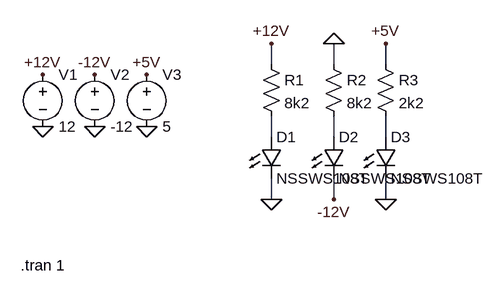
[diagram p0: schematic Draft3.asc]
Draft3.asc, the LTspice schematic file:
Version 4
SHEET 1 880 680
WIRE 336 96 336 64
WIRE 432 96 432 64
WIRE 512 96 512 64
WIRE 336 208 336 176
WIRE 432 208 432 176
WIRE 512 208 512 176
WIRE 336 304 336 272
WIRE 432 304 432 272
WIRE 512 304 512 272
FLAG -16 192 0
FLAG 64 192 0
FLAG 144 192 0
FLAG -16 112 +12V
FLAG 64 112 -12V
FLAG 144 112 +5V
FLAG 336 304 0
FLAG 512 304 0
FLAG 432 64 0
FLAG 336 64 +12V
FLAG 512 64 +5V
FLAG 432 304 -12V
SYMBOL voltage -16 96 R0
WINDOW 123 0 0 Left 0
WINDOW 39 0 0 Left 0
SYMATTR InstName V1
SYMATTR Value 12
SYMBOL voltage 64 96 R0
WINDOW 123 0 0 Left 0
WINDOW 39 0 0 Left 0
SYMATTR InstName V2
SYMATTR Value -12
SYMBOL voltage 144 96 R0
WINDOW 123 0 0 Left 0
WINDOW 39 0 0 Left 0
SYMATTR InstName V3
SYMATTR Value 5
SYMBOL res 320 80 R0
SYMATTR InstName R1
SYMATTR Value 8k2
SYMBOL res 416 80 R0
SYMATTR InstName R2
SYMATTR Value 8k2
SYMBOL res 496 80 R0
SYMATTR InstName R3
SYMATTR Value 2k2
SYMBOL LED 320 208 R0
SYMATTR InstName D1
SYMATTR Value NSSWS108T
SYMBOL LED 416 208 R0
SYMATTR InstName D2
SYMATTR Value NSSWS108T
SYMBOL LED 496 208 R0
SYMATTR InstName D3
SYMATTR Value NSSWS108T
TEXT -50 406 Left 2 !.tran 1

The netlist it stands for:
* Draft3.asc
V1 +12V 0 12
V2 -12V 0 -12
V3 +5V 0 5
R1 +12V N001 8k2
R2 0 N002 8k2
R3 +5V N003 2k2
D1 N001 0 NSSWS108T
D2 N002 -12V NSSWS108T
D3 N003 0 NSSWS108T
.model D D
.lib standard.dio
.tran 1
.backanno
.end